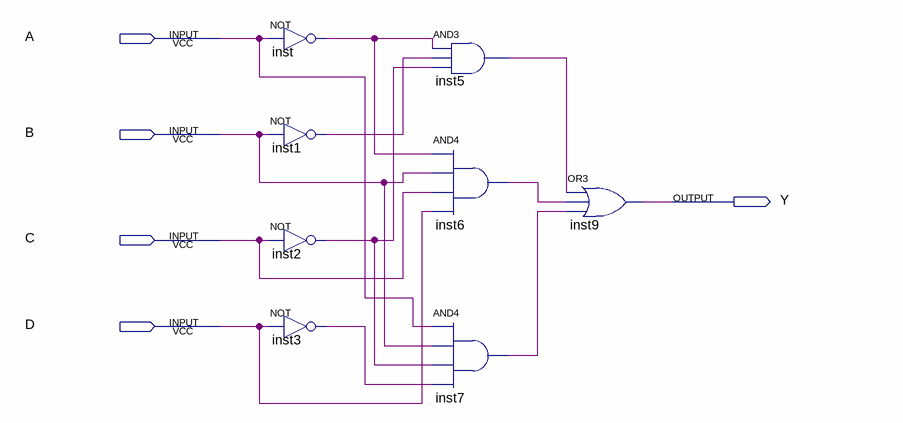
[diagram p0: schematic sheet]
// Quartus schematic circuit6.bdf as structural Verilog: 8 symbols, 5 pins
module circuit6 (
  input  A,
  input  B,
  input  C,
  input  D,
  output Y
);

  wire inst1_out, inst2_out, inst3_out, inst5_out, inst6_out, inst7_out, inst_out;

  not inst (inst_out, A);
  not inst1 (inst1_out, B);
  not inst2 (inst2_out, C);
  not inst3 (inst3_out, D);
  and inst5 (inst5_out, inst_out, inst1_out, inst2_out);
  and inst6 (inst6_out, inst_out, B, C, D);
  and inst7 (inst7_out, A, B, inst2_out, inst3_out);
  or inst9 (Y, inst5_out, inst6_out, inst7_out);
endmodule
